# Altium schematic sheet UPCNSL-ABS-FLS-ARD_v1.2.SchDoc
size A1
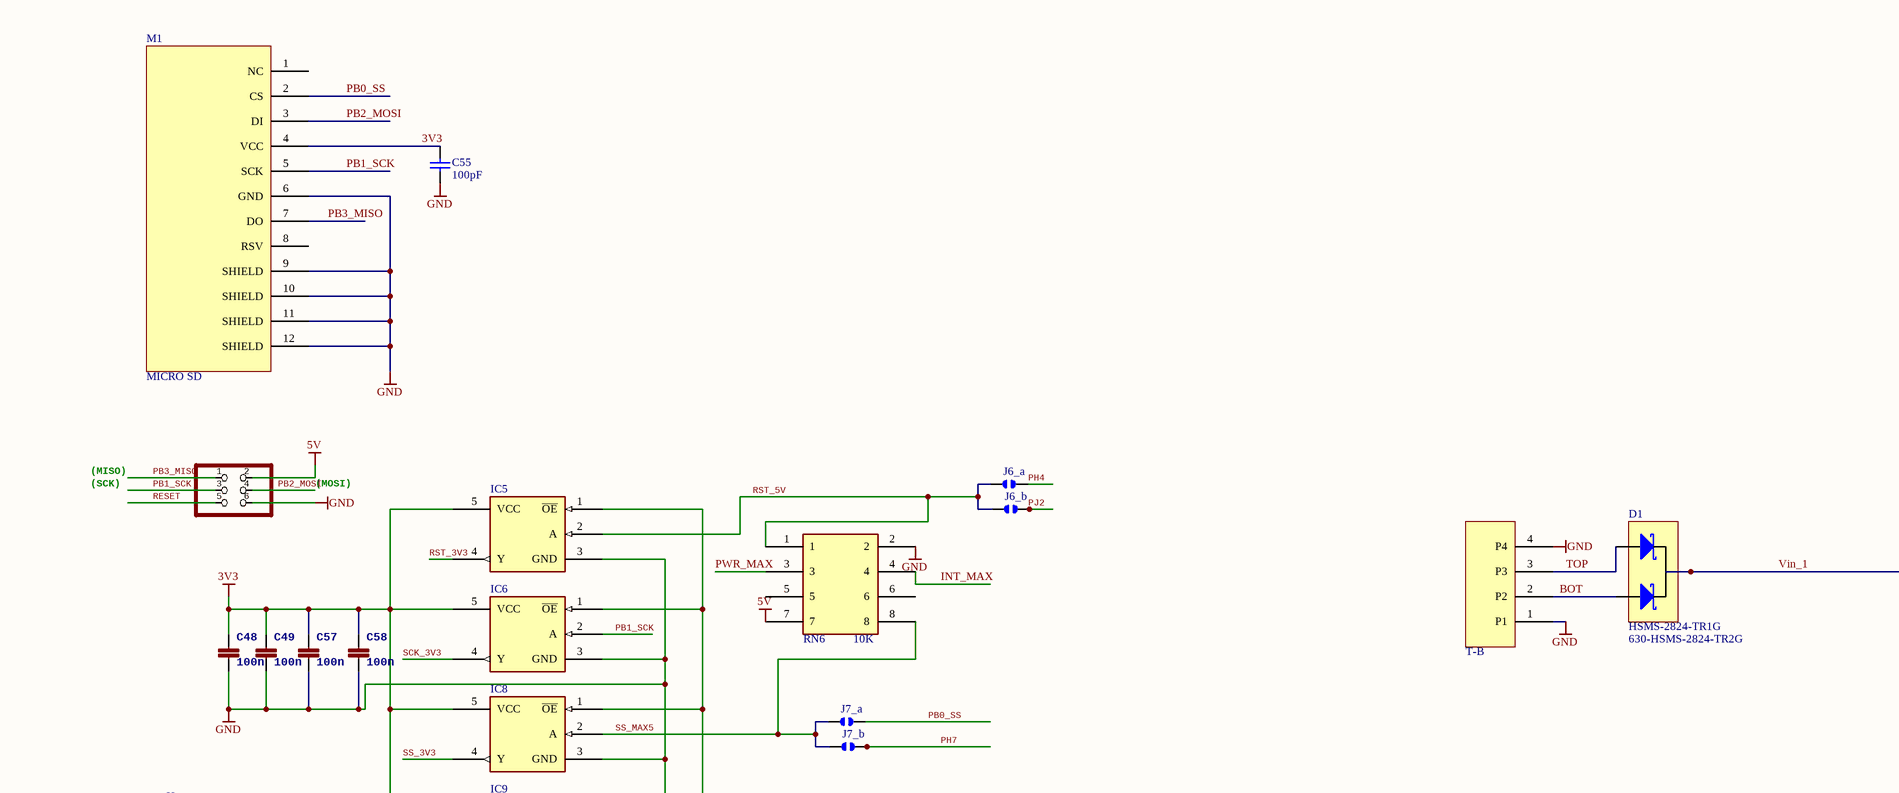
[diagram p0: UPCNSL-ABS-FLS-ARD_v1.2.SchDoc, top left]
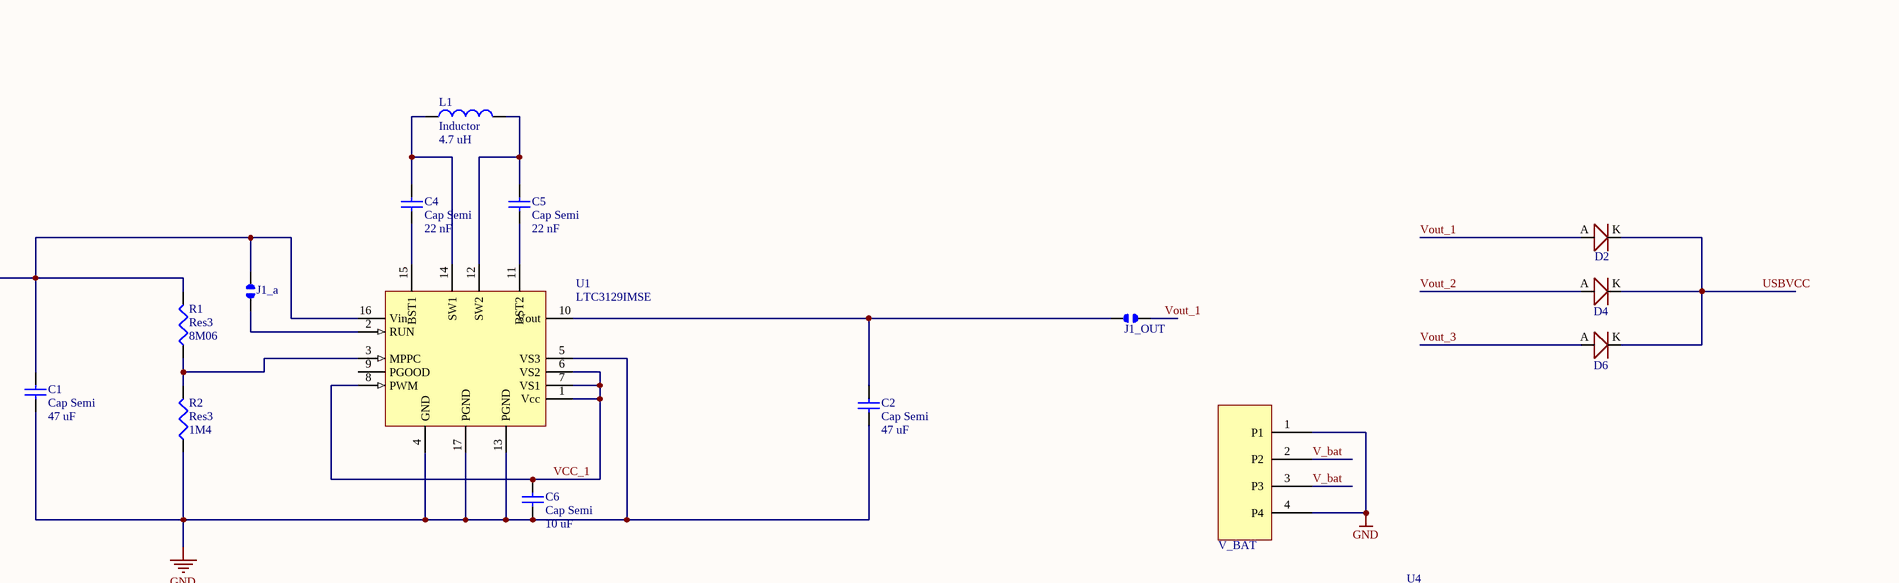
[diagram p1: UPCNSL-ABS-FLS-ARD_v1.2.SchDoc, top right]
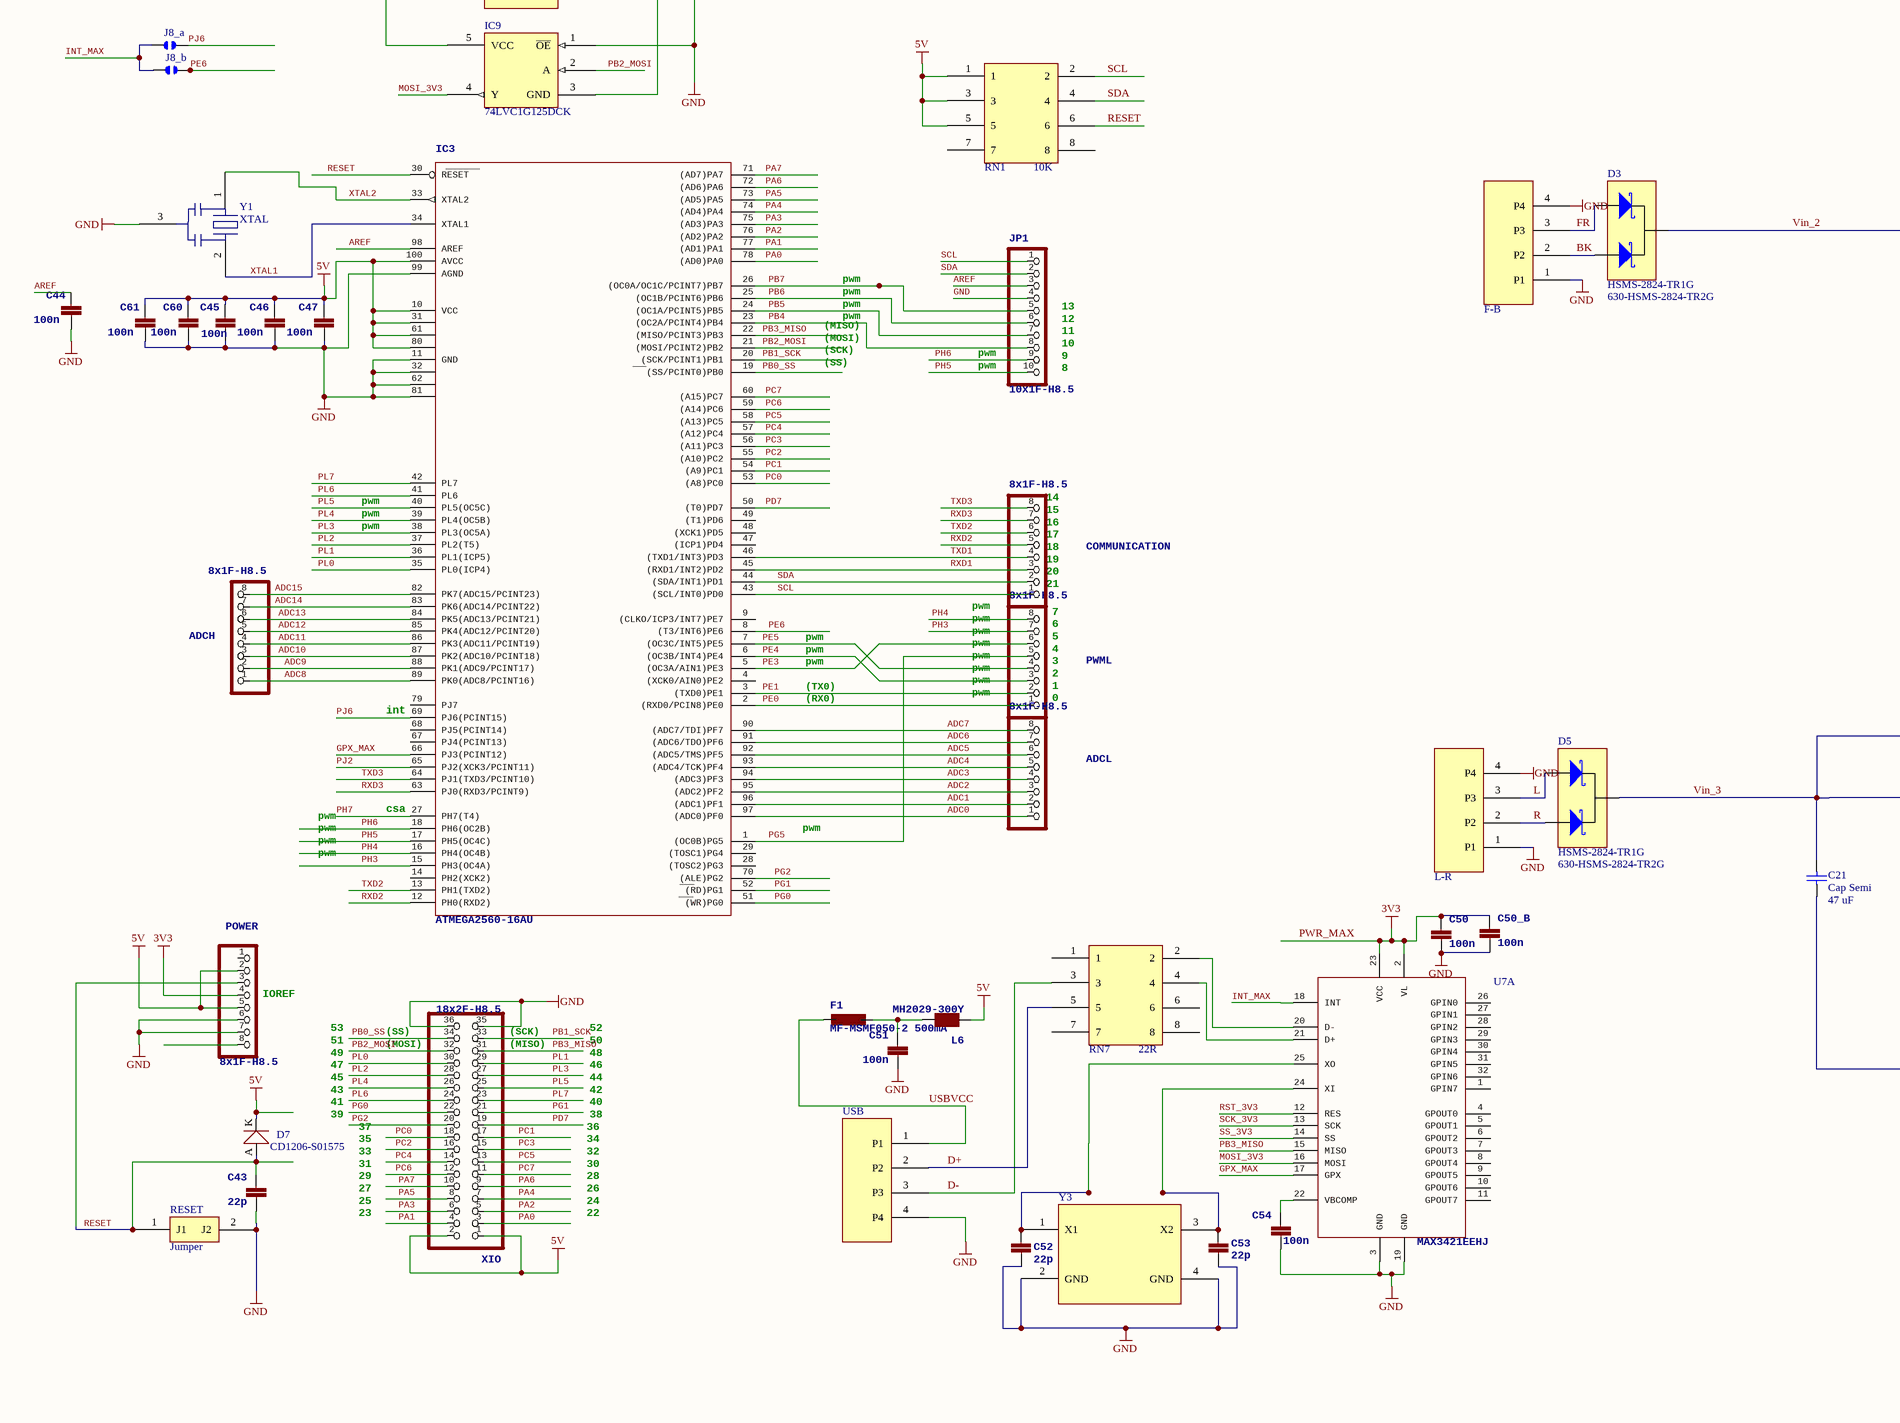
[diagram p2: UPCNSL-ABS-FLS-ARD_v1.2.SchDoc, bottom left]
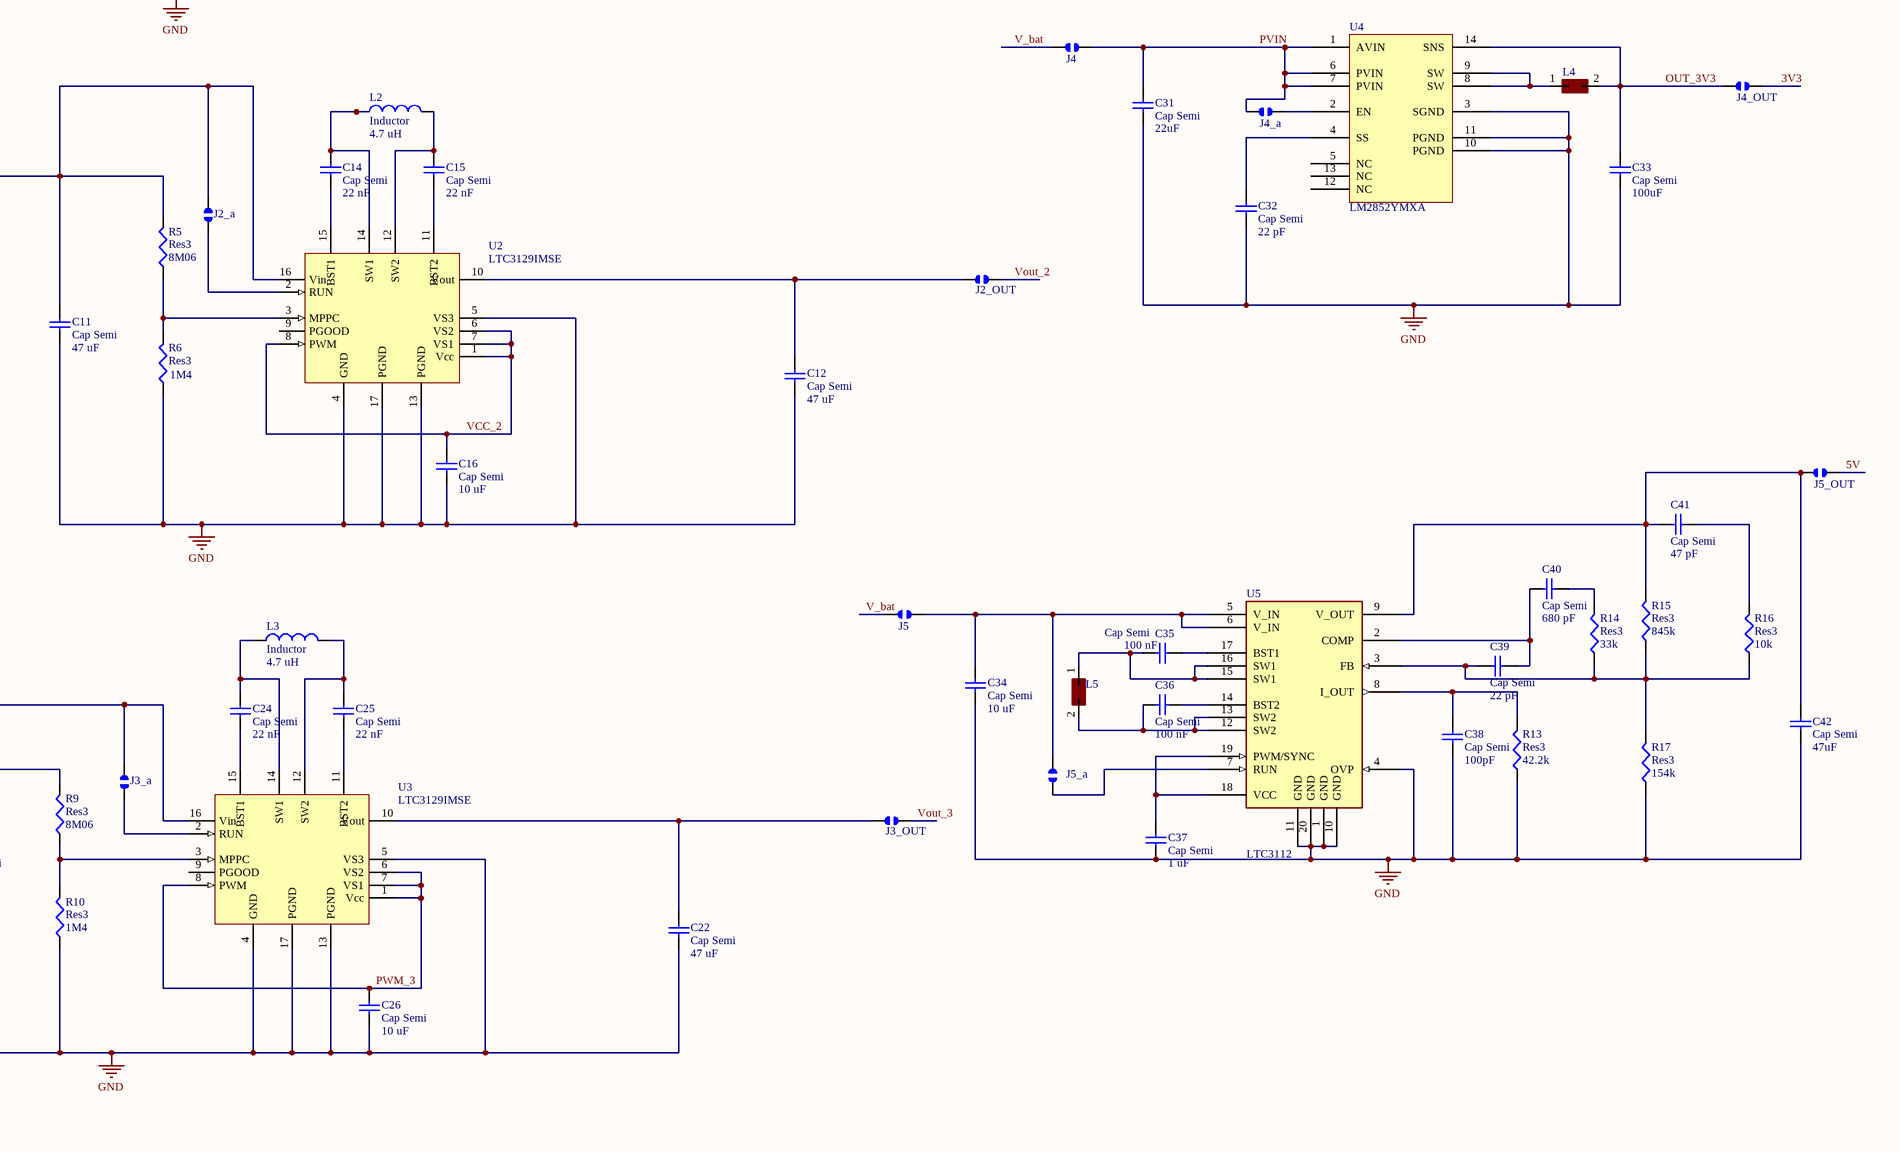
[diagram p3: UPCNSL-ABS-FLS-ARD_v1.2.SchDoc, bottom right]

## Parts
ADCH  8x1F-H8.5  [ADCH]
ADCL  8x1F-H8.5  [ADCL]
C1  Cap Semi  value 47 uF  [C1206]
C2  Cap Semi  value 47 uF  [C1206]
C4  Cap Semi  value 22 nF  [CAP0603]
C5  Cap Semi  value 22 nF  [CAP0603]
C6  Cap Semi  value 10 uF  [CAP0603]
C11  Cap Semi  value 47 uF  [C1206]
C12  Cap Semi  value 47 uF  [C1206]
C14  Cap Semi  value 22 nF  [CAP0603]
C15  Cap Semi  value 22 nF  [CAP0603]
C16  Cap Semi  value 10 uF  [CAP0603]
C21  Cap Semi  value 47 uF  [C1206]
C22  Cap Semi  value 47 uF  [C1206]
C24  Cap Semi  value 22 nF  [CAP0603]
C25  Cap Semi  value 22 nF  [CAP0603]
C26  Cap Semi  value 10 uF  [CAP0603]
C31  Cap Semi  value 22uF  [C1206]
C32  Cap Semi  value 22 pF  [CAP0603]
C33  Cap Semi  value 100uF  [C0805]
C34  Cap Semi  value 10 uF  [CAP0603]
C35  Cap Semi  value 100 nF  [CAP0603]
C36  Cap Semi  value 100 nF  [CAP0603]
C37  Cap Semi  value 1 uF  [CAP0603]
C38  Cap Semi  value 100pF  [CAP0603]
C39  Cap Semi  value 22 pF  [CAP0603]
C40  Cap Semi  value 680 pF  [CAP0603]
C41  Cap Semi  value 47 pF  [CAP0603]
C42  Cap Semi  value 47uF  [C1206]
C43  >NAME: C43  [CAP0603]  (hidden comment: 22p)
C44  100n  [CAP0603]
C45  100n  [CAP0603]
C46  100n  [CAP0603]
C47  100n  [CAP0603]
C48  >NAME: C48  [CAP0603]  (hidden comment: 100n)
C49  >NAME: C49  [CAP0603]  (hidden comment: 100n)
C50  >NAME: C50  [CAP0603]  (hidden comment: 100n)
C50_B  >NAME: C50_B  [CAP0603]  (hidden comment: 100n)
C51  >NAME: C51  [CAP0603]  (hidden comment: 100n)
C52  22p  [CAP0603]
C53  22p  [CAP0603]
C54  >NAME: C54  [CAP0603]  (hidden comment: 100n)
C55  value 100pF  [CAP0603]  (hidden comment: CAP0603)
C57  >NAME: C57  [CAP0603]  (hidden comment: 100n)
C58  >NAME: C58  [CAP0603]  (hidden comment: 100n)
C60  100n  [CAP0603]
C61  100n  [CAP0603]
COMMUNICATION  8x1F-H8.5  [COMMUNICATION]
D1  HSMS-2824-TR1G  Supplier Part Number 1: 630-HSMS-2824-TR2G  [SOT23-3]
D2  DIODE  [(Schottky diode) SODFL160X70-2N]  (value not drawn)
D3  HSMS-2824-TR1G  Supplier Part Number 1: 630-HSMS-2824-TR2G  [SOT23-3]
D4  DIODE  [(Schottky diode) SODFL160X70-2N]  (value not drawn)
D5  HSMS-2824-TR1G  Supplier Part Number 1: 630-HSMS-2824-TR2G  [SOT23-3]
D6  DIODE  [(Schottky diode) SODFL160X70-2N]  (value not drawn)
D7  CD1206-S01575  [SMD DIODE]
F2  >NAME: F1  [FUSE]  (hidden comment: MF-MSMF050-2 500mA)
F-B  HEADER_CONNECTION  [HEADER_CONNECTION]  (value not drawn)
IC3  ATMEGA2560-16AU  [TSQFP50P1600X1600X120-100N]
IC5  74LVC1G125DCK  [SOT65P210X110-5N]  (value not drawn)
IC6  74LVC1G125DCK  [SOT65P210X110-5N]  (value not drawn)
IC8  74LVC1G125DCK  [SOT65P210X110-5N]  (value not drawn)
IC9  74LVC1G125DCK  [SOT65P210X110-5N]
ICSP  3x2M  [Header 3x2]  (value not drawn)
J1_a  Jumper_Solderpad  [JUMPER_SOLDERPAD]  (value not drawn)
J1_OUT  Jumper_Solderpad  [JUMPER_SOLDERPAD]  (value not drawn)
J2_a  Jumper_Solderpad  [JUMPER_SOLDERPAD]  (value not drawn)
J2_OUT  Jumper_Solderpad  [JUMPER_SOLDERPAD]  (value not drawn)
J3_a  Jumper_Solderpad  [JUMPER_SOLDERPAD]  (value not drawn)
J3_OUT  Jumper_Solderpad  [JUMPER_SOLDERPAD]  (value not drawn)
J4  Jumper_Solderpad  [JUMPER_SOLDERPAD]  (value not drawn)
J4_a  Jumper_Solderpad  [JUMPER_SOLDERPAD]  (value not drawn)
J4_OUT  Jumper_Solderpad  [JUMPER_SOLDERPAD]  (value not drawn)
J5  Jumper_Solderpad  [JUMPER_SOLDERPAD]  (value not drawn)
J5_a  Jumper_Solderpad  [JUMPER_SOLDERPAD]  (value not drawn)
J5_OUT  Jumper_Solderpad  [JUMPER_SOLDERPAD]  (value not drawn)
J6_a  Jumper_Solderpad  [JUMPER_SOLDERPAD]  (value not drawn)
J6_b  Jumper_Solderpad  [JUMPER_SOLDERPAD]  (value not drawn)
J7_a  Jumper_Solderpad  [JUMPER_SOLDERPAD]  (value not drawn)
J7_b  Jumper_Solderpad  [JUMPER_SOLDERPAD]  (value not drawn)
J8_a  Jumper_Solderpad  [JUMPER_SOLDERPAD]  (value not drawn)
J8_b  Jumper_Solderpad  [JUMPER_SOLDERPAD]  (value not drawn)
JP1  >NAME: JP1  [HEADER 1X10]  (hidden comment: 10x1F-H8.5)
L1  Inductor  value 4.7 uH  [CAP0603]
L2  Inductor  value 4.7 uH  [CAP0603]
L3  Inductor  value 4.7 uH  [CAP0603]
L4  INDUCTOR  [INDUCTOR - 74405215]  (value not drawn)
L5  INDUCTOR  [INDUCTOR - 1008[2520]]  (value not drawn)
L7  >NAME: L6  [INDUCTOR]  (hidden comment: MH2029-300Y)
L-R  HEADER_CONNECTION  [HEADER_CONNECTION]  (value not drawn)
M1  MICRO SD  [Micro SD holder]
POWER  8x1F-H8.5  [POWER]
PWML  8x1F-H8.5  [PWM]
R1  Res3  value 8M06  [J1-0603]
R2  Res3  value 1M4  [J1-0603]
R5  Res3  value 8M06  [J1-0603]
R6  Res3  value 1M4  [J1-0603]
R9  Res3  value 8M06  [J1-0603]
R10  Res3  value 1M4  [J1-0603]
R13  Res3  value 42.2k  [J1-0603]
R14  Res3  value 33k  [J1-0603]
R15  Res3  value 845k  [J1-0603]
R16  Res3  value 10k  [J1-0603]
R17  Res3  value 154k  [J1-0603]
RESET  Jumper  [Jumper]
RN1  10K  [CAF-80P319X159-8N]
RN6  10K  [CAF-80P319X159-8N]
RN7  22R  [CAF-80P319X159-8N]
T-B  HEADER_CONNECTION  [HEADER_CONNECTION]  (value not drawn)
U1  LTC3129IMSE  [MSOP-16]
U2  LTC3129IMSE  [MSOP-16]
U3  LTC3129IMSE  [MSOP-16]
U4  LM2852YMXA  [TSOP65P650X110-14N (LM2852YMXA)]
U5  LTC3112  [SSOP-SS20]
U7A  MAX3421EEHJ  [TSQFP50P700X700X120-32N]
USB  HEADER_CONNECTION  [HEADER_CONNECTION]  (value not drawn)
V_BAT  HEADER_CONNECTION  [HEADER_CONNECTION]  (value not drawn)
XIO  >NAME: XIO  [HEADER 2X18]  (hidden comment: 18x2F-H8.5)
Y1  XTAL  [RESONATOR 3 PINS]
Y3  Crystal  [CRYSTAL]  (value not drawn)

## Nets
3V3: C48.1 C49.1 C50.1 C50_B.1 C55.2 C57.1 C58.1 IC5.5(VCC) IC6.5(VCC) IC8.5(VCC) IC9.5(VCC) J4_OUT.2 M1.4(VCC) POWER.4 RN6.3 U7A.2(VL) U7A.23(VCC)  [also labelled PWR_MAX]
5V: C45.1 C46.1 C47.1 C60.1 C61.1 D7.K IC3.10(VCC) IC3.31(VCC1) IC3.61(VCC2) IC3.80(VCC3) IC3.100(AVCC) ICSP.2 J5_OUT.2 L7.1 POWER.2 POWER.5 RN1.1 RN1.3 RN1.5 RN6.7 XIO.1 XIO.2
GND: C1.1 C2.1 C6.1 C11.1 C12.1 C16.1 C21.1 C22.1 C26.1 C31.2 C32.1 C33.2 C34.1 C37.1 C38.1 C42.2 C43.2 C44.2 C45.2 C46.2 C47.2 C48.2 C49.2 C50.2 C50_B.2 C51.2 C52.1 C53.1 C54.2 C55.1 C57.2 C58.2 C60.2 C61.2 F-B.1(P1) F-B.4(P4) IC3.11(GND) IC3.32(GND1) IC3.62(GND2) IC3.81(GND3) IC3.99(AGND) IC5.1(~{OE}) IC5.3(GND) IC6.1(~{OE}) IC6.3(GND) IC8.1(~{OE}) IC8.3(GND) IC9.1(~{OE}) IC9.3(GND) ICSP.6 JP1.4 L-R.1(P1) L-R.4(P4) M1.6(GND) M1.9(SHIELD) M1.10(SHIELD) M1.11(SHIELD) M1.12(SHIELD) POWER.6 POWER.7 R2.1 R6.1 R10.1 R13.1 R17.1 RESET.2(J2) RN6.2 T-B.1(P1) T-B.4(P4) U1.4(GND) U1.5(VS3) U1.13(PGND) U1.17(PGND) U2.4(GND) U2.5(VS3) U2.13(PGND) U2.17(PGND) U3.4(GND) U3.5(VS3) U3.13(PGND) U3.17(PGND) U4.3(SGND) U4.10(PGND) U4.11(PGND) U5.1(GND) U5.4(OVP) U5.10(GND) U5.11(GND) U5.20(GND) U7A.3(GND) U7A.19(GND) USB.4(P4) V_BAT.1(P1) V_BAT.4(P4) XIO.35 XIO.36 Y1.3 Y3.2(GND) Y3.4(GND)
ADC0: ADCL.1 IC3.97((ADC0)PF0)
ADC1: ADCL.2 IC3.96((ADC1)PF1)
ADC2: ADCL.3 IC3.95((ADC2)PF2)
ADC3: ADCL.4 IC3.94((ADC3)PF3)
ADC4: ADCL.5 IC3.93((ADC4/TCK)PF4)
ADC5: ADCL.6 IC3.92((ADC5/TMS)PF5)
ADC6: ADCL.7 IC3.91((ADC6/TDO)PF6)
ADC7: ADCL.8 IC3.90((ADC7/TDI)PF7)
ADC8: ADCH.1 IC3.89(PK0(ADC8/PCINT16))
ADC9: ADCH.2 IC3.88(PK1(ADC9/PCINT17))
ADC10: ADCH.3 IC3.87(PK2(ADC10/PCINT18))
ADC11: ADCH.4 IC3.86(PK3(ADC11/PCINT19))
ADC12: ADCH.5 IC3.85(PK4(ADC12/PCINT20))
ADC13: ADCH.6 IC3.84(PK5(ADC13/PCINT21))
ADC14: ADCH.7 IC3.83(PK6(ADC14/PCINT22))
ADC15: ADCH.8 IC3.82(PK7(ADC15/PCINT23))
AREF: C44.1 IC3.98(AREF) JP1.3
BK: D3.2(A2) F-B.2(P2)
BOT: D1.2(A2) T-B.2(P2)
D+: RN7.5 USB.2(P2)
D-: RN7.3 USB.3(P3)
FR: D3.1(A1) F-B.3(P3)
GPX_MAX: IC3.66(PJ3(PCINT12)) U7A.17(GPX)
INT_MAX: J8_a.1 J8_b.1 RN6.4 U7A.18(INT)
L: D5.1(A1) L-R.3(P3)
MOSI_3V3: IC9.4(Y) U7A.16(MOSI)
OUT_3V3: C33.1 J4_OUT.1 L4.2 U4.14(SNS)
PA0: IC3.78((AD0)PA0) XIO.3
PA1: IC3.77((AD1)PA1) XIO.4
PA2: IC3.76((AD2)PA2) XIO.5
PA3: IC3.75((AD3)PA3) XIO.6
PA4: IC3.74((AD4)PA4) XIO.7
PA5: IC3.73((AD5)PA5) XIO.8
PA6: IC3.72((AD6)PA6) XIO.9
PA7: IC3.71((AD7)PA7) XIO.10
PB0_SS: IC3.19((SS/PCINT0)PB0) J7_a.2 M1.2(CS) XIO.34
PB1_SCK: IC3.20((SCK/PCINT1)PB1) IC6.2(A) ICSP.3 M1.5(SCK) XIO.33
PB2_MOSI: IC3.21((MOSI/PCINT2)PB2) IC9.2(A) ICSP.4 M1.3(DI) XIO.32
PB3_MISO: IC3.22((MISO/PCINT3)PB3) ICSP.1 M1.7(DO) U7A.15(MISO) XIO.31
PB4: IC3.23((OC2A/PCINT4)PB4) JP1.8
PB5: IC3.24((OC1A/PCINT5)PB5) JP1.7
PB6: IC3.25((OC1B/PCINT6)PB6) JP1.6
PB7: IC3.26((OC0A/OC1C/PCINT7)PB7) JP1.5
PC0: IC3.53((A8)PC0) XIO.18
PC1: IC3.54((A9)PC1) XIO.17
PC2: IC3.55((A10)PC2) XIO.16
PC3: IC3.56((A11)PC3) XIO.15
PC4: IC3.57((A12)PC4) XIO.14
PC5: IC3.58((A13)PC5) XIO.13
PC6: IC3.59((A14)PC6) XIO.12
PC7: IC3.60((A15)PC7) XIO.11
PD7: IC3.50((T0)PD7) XIO.19
PE0: IC3.2((RXD0/PCIN8)PE0) PWML.1
PE1: IC3.3((TXD0)PE1) PWML.2
PE3: IC3.5((OC3A/AIN1)PE3) PWML.6
PE4: IC3.6((OC3B/INT4)PE4) PWML.3
PE5: IC3.7((OC3C/INT5)PE5) PWML.4
PE6: IC3.8((T3/INT6)PE6) J8_b.2
PG0: IC3.51((WR)PG0) XIO.22
PG1: IC3.52((RD)PG1) XIO.21
PG2: IC3.70((ALE)PG2) XIO.20
PG5: IC3.1((OC0B)PG5) PWML.5
PH3: IC3.15(PH3(OC4A)) PWML.7
PH4: IC3.16(PH4(OC4B)) J6_a.2 PWML.8
PH5: IC3.17(PH5(OC4C)) JP1.10
PH6: IC3.18(PH6(OC2B)) JP1.9
PH7: IC3.27(PH7(T4)) J7_b.2
PJ2: IC3.65(PJ2(XCK3/PCINT11)) J6_b.2
PJ6: IC3.69(PJ6(PCINT15)) J8_a.2
PL0: IC3.35(PL0(ICP4)) XIO.30
PL1: IC3.36(PL1(ICP5)) XIO.29
PL2: IC3.37(PL2(T5)) XIO.28
PL3: IC3.38(PL3(OC5A)) XIO.27
PL4: IC3.39(PL4(OC5B)) XIO.26
PL5: IC3.40(PL5(OC5C)) XIO.25
PL6: IC3.41(PL6) XIO.24
PL7: IC3.42(PL7) XIO.23
PVIN: C31.1 J4.2 J4_a.1 U4.1(AVIN) U4.6(PVIN) U4.7(PVIN)
PWM_3: C26.2 U3.1(Vcc) U3.6(VS2) U3.7(VS1) U3.8(PWM)
R: D5.2(A2) L-R.2(P2)
RESET: C43.1 D7.A IC3.30(RESET) ICSP.5 POWER.3 RESET.1(J1) RN1.6
RST_3V3: IC5.4(Y) U7A.12(RES)
RST_5V: IC5.2(A) J6_a.1 J6_b.1 RN6.1
RXD1: COMMUNICATION.3 IC3.45((RXD1/INT2)PD2)
RXD2: COMMUNICATION.5 IC3.12(PH0(RXD2))
RXD3: COMMUNICATION.7 IC3.63(PJ0(RXD3/PCINT9))
SCK_3V3: IC6.4(Y) U7A.13(SCK)
SCL: COMMUNICATION.1 IC3.43((SCL/INT0)PD0) JP1.1 RN1.2
SDA: COMMUNICATION.2 IC3.44((SDA/INT1)PD1) JP1.2 RN1.4
SS_3V3: IC8.4(Y) U7A.14(SS)
SS_MAX5: IC8.2(A) J7_a.1 J7_b.1 RN6.8
TOP: D1.1(A1) T-B.3(P3)
TXD1: COMMUNICATION.4 IC3.46((TXD1/INT3)PD3)
TXD2: COMMUNICATION.6 IC3.13(PH1(TXD2))
TXD3: COMMUNICATION.8 IC3.64(PJ1(TXD3/PCINT10))
USBVCC: D2.K D4.K D6.K F2.2 USB.1(P1)
V_bat: J4.1 J5.1 V_BAT.2(P2) V_BAT.3(P3)
VCC_1: C6.2 U1.1(Vcc) U1.6(VS2) U1.7(VS1) U1.8(PWM)
VCC_2: C16.2 U2.1(Vcc) U2.6(VS2) U2.7(VS1) U2.8(PWM)
Vin_1: C1.2 D1.3(K) J1_a.2 R1.2 U1.16(Vin)
Vin_2: C11.2 D3.3(K) J2_a.2 R5.2 U2.16(Vin)
Vin_3: C21.2 D5.3(K) J3_a.2 R9.2 U3.16(Vin)
Vout_1: D2.A J1_OUT.2
Vout_2: D4.A J2_OUT.2
Vout_3: D6.A J3_OUT.2
XTAL1: IC3.34(XTAL1) Y1.2
XTAL2: IC3.33(XTAL2) Y1.1
NetC2_2: C2.2 J1_OUT.1 U1.10(Vout)
NetC4_1: C4.1 U1.15(BST1)
NetC4_2: C4.2 L1.1 U1.14(SW1)
NetC5_1: C5.1 U1.11(BST2)
NetC5_2: C5.2 L1.2 U1.12(SW2)
NetC12_2: C12.2 J2_OUT.1 U2.10(Vout)
NetC14_1: C14.1 U2.15(BST1)
NetC14_2: C14.2 L2.1 U2.14(SW1)
NetC15_1: C15.1 U2.11(BST2)
NetC15_2: C15.2 L2.2 U2.12(SW2)
NetC22_2: C22.2 J3_OUT.1 U3.10(Vout)
NetC24_1: C24.1 U3.15(BST1)
NetC24_2: C24.2 L3.1 U3.14(SW1)
NetC25_1: C25.1 U3.11(BST2)
NetC25_2: C25.2 L3.2 U3.12(SW2)
NetC32_2: C32.2 U4.4(SS)
NetC34_2: C34.2 J5.2 J5_a.2 U5.5(V_IN) U5.6(V_IN)
NetC35_1: C35.1 L5.1 U5.15(SW1) U5.16(SW1)
NetC35_2: C35.2 U5.17(BST1)
NetC36_1: C36.1 L5.2 U5.12(SW2) U5.13(SW2)
NetC36_2: C36.2 U5.14(BST2)
NetC37_2: C37.2 U5.18(VCC) U5.19(PWM/SYNC)
NetC38_2: C38.2 R13.2 U5.8(I_OUT)
NetC39_1: C39.1 R14.1 R15.1 R16.1 R17.2 U5.3(FB)
NetC39_2: C39.2 C40.1 U5.2(COMP)
NetC40_2: C40.2 R14.2
NetC41_1: C41.1 C42.1 J5_OUT.1 R15.2 U5.9(V_OUT)
NetC41_2: C41.2 R16.2
NetC51_1: C51.1 F2.1 L7.2
NetC52_2: C52.2 U7A.25(XO) Y3.1(X1)
NetC53_2: C53.2 U7A.24(XI) Y3.3(X2)
NetC54_1: C54.1 U7A.22(VBCOMP)
NetJ1_a_1: J1_a.1 U1.2(RUN)
NetJ2_a_1: J2_a.1 U2.2(RUN)
NetJ3_a_1: J3_a.1 U3.2(RUN)
NetJ4_a_2: J4_a.2 U4.2(EN)
NetJ5_a_1: J5_a.1 U5.7(RUN)
NetL4_1: L4.1 U4.8(SW) U4.9(SW)
NetR1_1: R1.1 R2.2 U1.3(MPPC)
NetR5_1: R5.1 R6.2 U2.3(MPPC)
NetR9_1: R9.1 R10.2 U3.3(MPPC)
NetRN7_2: RN7.2 U7A.20(D-)
NetRN7_4: RN7.4 U7A.21(D+)

Not connected (* = marked no-connect by the designer): IC3 4((XCK0/AIN0)PE2) 9((CLKO/ICP3/INT7)PE7) 14(PH2(XCK2)) 28((TOSC2)PG3) 29((TOSC1)PG4) 47((ICP1)PD4) 48((XCK1)PD5) 49((T1)PD6) 67(PJ4(PCINT13)) 68(PJ5(PCINT14)) 79(PJ7); M1 1(NC) 8(RSV); POWER 1 8; RN1 7 8; RN6 5 6; RN7 1 6 7 8; U1 9(PGOOD); U2 9(PGOOD); U3 9(PGOOD); U4 5(NC) 12(NC) 13(NC); U7A 1(GPIN7) 4(GPOUT0) 5(GPOUT1) 6(GPOUT2) 7(GPOUT3) 8(GPOUT4) 9(GPOUT5) 10(GPOUT6) 11(GPOUT7) 26(GPIN0) 27(GPIN1) 28(GPIN2) 29(GPIN3) 30(GPIN4) 31(GPIN5) 32(GPIN6)

## Notes on the sheet
- (SCK)
- (MISO)
- (MOSI)
- pwm
- (SS)
- (near JP1) pwm
- (near JP1) 9
- (near JP1) 10
- (near JP1) 11
- (near JP1) 12
- (near JP1) 13
- (near JP1) 8
- (near COMMUNICATION) 15
- (near COMMUNICATION) 16
- (near COMMUNICATION) 17
- (near COMMUNICATION) 18
- (near COMMUNICATION) 14
- (near COMMUNICATION) 19
- (near COMMUNICATION) 20
- (near COMMUNICATION) 21
- (near PWML) 2
- (near PWML) 3
- (near PWML) 4
- (near PWML) 5
- (near PWML) 6
- 7
- (near IC3) int
- (TX0)
- (RX0)
- (near PWML) 0
- (near PWML) 1
- (near IC3) csa
- (near POWER) IOREF
- 51
- 53
- (near XIO) (MOSI)
- (near XIO) (SCK)
- (near XIO) (MISO)
- 52
- 50
- 49
- 47
- 45
- 43
- 41
- 48
- 46
- 44
- 42
- 40
- 39
- 31
- 33
- 35
- 37
- 30
- 32
- 34
- 36
- 38
- 23
- 25
- 27
- 29
- 22
- 24
- 26
- 28

## Library data of the parts
ADCH ADCL COMMUNICATION POWER PWML = PINHD-1X8: <b>PIN HEADER</b>
C1 C2 C4-C6 C11 C12 C14-C16 C21 C22 C24-C26 C31-C42 = Cap Semi: Capacitor (Semiconductor SIM Model); Published: 8-Jun-2000; LatestRevisionDate: 29-May-2009; LatestRevisionNote: IPC-7351 Footprint Added.; PackageReference: C1206; Publisher: Altium Limited; PackageDescription: Chip Capacitor
C43-C50 C50_B C51-C54 C57 C58 C60 C61 = C-EU0603-RND: <B>CAPACITOR</B>, European symbol
  C43: >VALUE: 22p
  C48-C50 C50_B C51 C54 C57 C58: >VALUE: 100n
C55 = CAP0603: Capacitor
D1 D3 D5 = HSMS-2824-TR1G: DIODE, RF, SCHOTTKY, DUAL, SOT-23; Supplier 1: Mouser
D7 = DIODE
F2 = L-EUL1812: <B>INDUCTOR</B>, European symbol; >VALUE: MF-MSMF050-2 500mA
F-B = HEADER_CONNECTION: Front and Back connections
IC3 = ATMEGA2560AU: <b>MICROCONTROLLER</b><p> / 64/128/256 Kbytes FLASH<p> / 4 Kbytes EEPROM<p> / 8 Kbytes SRAM<p> / 86 General Purpose I/O pins<p> / 12-channels16-bit PWM<p> / 4 x Serial USARTs<p> / 16-channels 10-bit A/D<p>
ICSP = PINHD-2X3: <b>PIN HEADER</b>; >NAME: ICSP; >VALUE: 3x2M
JP1 = PINHD-1X10: <b>PIN HEADER</b>; >VALUE: 10x1F-H8.5
L1-L3 = Inductor: Code_IEC: 1005; Published: 8-Jun-2000; LatestRevisionDate: 29-May-2009; LatestRevisionNote: IPC-7351 Footprint Added.; PackageReference: 0402-A; Publisher: Altium Limited; PackageDescription: Chip Inductor; Code_JEITA: 0402
L7 = WE-CBF_0805: SMD EMI Suppression Ferrite Beads / - excellent anti-EMI properties / - low DCR / - impedances till 3000 ohms / - rated current up to 6 A; >VALUE: MH2029-300Y
L-R = HEADER_CONNECTION: Left and Right connections
R1 R2 R5 R6 R9 R10 R13-R17 = Res3: Resistor; Published: 8-Jun-2000; LatestRevisionDate: 29-May-2009; LatestRevisionNote: IPC-7351 Footprint Added.; PackageReference: J1-0603; Publisher: Altium Limited; PackageDescription: Chip Resistor
RN1 RN6 RN7 = RES_ARRAY
T-B = HEADER_CONNECTION: Top and Bottom connections
U1-U3 = LTC3129: 15V, 200mA Synchronous Buck-Boost DC/DC Converter with 1.3µA Quiescent Current; Supplier 1: Digi-Key; Supplier Part Number 1: LTC3129IMSE#PBF-ND
U5 = LTC3112EDHD#PBF: IC REG BUCK BOOST ADJ 2.5A 16DFN; Supplier 1: Digi-Key
U7A = MAX3421EEHJ: MAX3421 SPI to USB Interface Chip
XIO = PINHD-2X18: <b>PIN HEADER</b>; >VALUE: 18x2F-H8.5
Y1 = RESONATOR 16MHz
IC5 IC6 IC8 IC9 = 74LVC1G125DCK: Supplier 1: Mouser; Supplier Part Number 1: 595-SN74LVC1G125DCKT